# Altium schematic sheet Communications.SchDoc
size A4
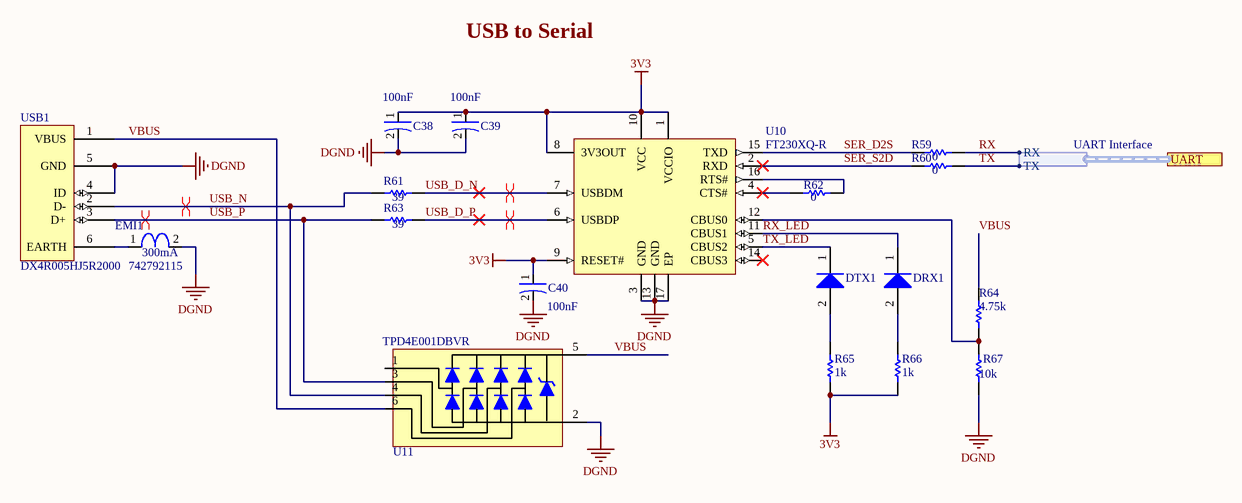
[diagram p0: Communications.SchDoc]

## Parts
C38  value 100nF  [0402-M]  (hidden comment: CAP 0.1uF CER 0402 16V X5R 10%)
C39  value 100nF  [0402-M]  (hidden comment: CAP 0.1uF CER 0402 16V X5R 10%)
C40  value 100nF  [0402-M]  (hidden comment: CAP 0.1uF CER 0402 16V X5R 10%)
DRX1  LED 0603 Green 20mA 1.8V  [0603 Generic]  (value not drawn)
DTX1  LED 0603 Red 20mA 1.7V  [0603 Generic]  (value not drawn)
EMI1  742792115  [1206-L]
R59  value 0  [0402-M]  (hidden comment: RES 0 0402 63mW)
R60  value 0  [0402-M]  (hidden comment: RES 0 0402 63mW)
R61  value 39  [0402-M]  (hidden comment: RES 39 0402 63mW 5%)
R62  value 0  [0402-M]  (hidden comment: RES 0 0402 63mW)
R63  value 39  [0402-M]  (hidden comment: RES 39 0402 63mW 5%)
R64  value 4.75k  [0402-M]  (hidden comment: RES 4.75k 0402 100mW 1%)
R65  value 1k  [0402-M]  (hidden comment: RES 1k 0402 63mW 1%)
R66  value 1k  [0402-M]  (hidden comment: RES 1k 0402 63mW 1%)
R67  value 10k  [0402-M]  (hidden comment: RES 10k 0402 63mW 5%)
U10  FT230XQ-R  [QFN-16_N - 0.3mm Vias]
U11  TPD4E001DBVR  [DBV6_N]
USB1  DX4R005HJ5R2000  [DX4R005HJ5R2000]

## Ports
UART (harness UART Interface)

## Harnesses
UART Interface: RX, TX

## Nets
3V3: C38.1(Anode) C39.1(Anode) C40.1(Anode) R65.1 R66.1 U10.1(VCCIO) U10.8(3V3OUT) U10.9(RESET#) U10.10(VCC)
DGND: C38.2(Cathode) C39.2(Cathode) C40.2(Cathode) EMI1.2 R67.1 U10.3(GND) U10.13(GND) U10.17(EP) U11.2(GND) USB1.4(ID) USB1.5(GND)
RX: R59.2 ; port UART.RX
RX_LED: DRX1.1 U10.11(CBUS1)
SER_D2S: R59.1 U10.15(TXD)
SER_S2D: R60.1 U10.2(RXD)
TX: R60.2 ; port UART.TX
TX_LED: DTX1.1 U10.5(CBUS2)
USB_D_N: R61.2 U10.7(USBDM)
USB_D_P: R63.2 U10.6(USBDP)
USB_N: R61.1 U11.4 USB1.2(D-)
USB_P: R63.1 U11.3 USB1.3(D+)
VBUS: R64.2 U11.5(GND) U11.6 USB1.1(VBUS)
NetDRX1_2: DRX1.2 R66.2
NetDTX1_2: DTX1.2 R65.2
NetEMI1_1: EMI1.1 USB1.6(EARTH)
NetR62_1: R62.1 U10.4(CTS#)
NetR62_2: R62.2 U10.16(RTS#)
NetR64_1: R64.1 R67.2 U10.12(CBUS0)

Not connected (* = marked no-connect by the designer): U10 14(CBUS3)*; U11 1

## Layout directives
differential pair: USB_D_N, USB_D_P, USB_N, USB_P

## Notes on the sheet
- USB to Serial

## Library data of the parts
C38-C40 = CAP 0.1uF CER 0402 16V X5R 10%-2: CAP-0.1uF-CER-0402-16V-X5R-10%; Manufacturer: Generic; Bin: CAP1-M1; Type: SMD; Supplier 1: Mouser; Supplier Part Number 1: 810-CGA2B2X5R1C104KA; Case/Package: 0402; Design Item ID: CAP 0.1uF CER 0402 16V X5R 10%; Source: Capacitor Library.SchLib; Status: Active
DRX1 = LED 0603 Green 20mA 1.8V-1: LED-0603-Green-20mA-1.8V-STOCK; Manufacturer: Generic; Bin: F2-DM1-1; Supplier 1: Mouser; Supplier Part Number 1: 645-598-8060-107F; Status: Active; Type: SMD; Case/Package: 0603; Design Item ID: LED 0603 Green 20mA 1.8V; Source: Diode Library.SchLib
DTX1 = LED 0603 Red 20mA 1.7V-1: LED-0603-Red-20mA-1.7V-STOCK; Manufacturer: Generic; Bin: F2-DM1-2; Supplier 1: Digi-Key; Supplier Part Number 1: 67-1551-6-ND; Status: Active; Type: SMD; Case/Package: 0603; Design Item ID: LED 0603 Red 20mA 1.7V; Source: Diode Library.SchLib
EMI1 = 74279211-2: FILTER-1206-CHIP-300mA-0.3Ohm-100MHz-25%; Manufacturer: Wurth; Value: 300mA; Bin: F2-L2-1; Supplier 1: Mouser; Supplier Part Number 1: 710-742792115; Status: Active; Type: SMD; Case/Package: 1206; ComponentLink1Description: Datasheet; ComponentLink1URL: https://eu.mouser.com/datasheet/2/445/742792115-1710682.pdf; Design Item ID: 74279211; Source: Inductor Library.SchLib
R59 R60 R62 = RES 0 0402 63mW-1: RES-0-0402-63mW-5%; Manufacturer: Generic; Bin: F1-RM1-5; MAPPING: 1(2,1,11.5k); Status: Active; Type: SMD; Case/Package: 0402; Design Item ID: RES 0 0402 63mW; Source: Resistor Library.SchLib
R61 R63 = RES 39 0402 63mW 5%-1: RES-39-0402-63mW-5%; Manufacturer: Generic; Bin: F1-R1-2; MAPPING: 1(2,1,11.5k); Status: Active; Type: SMD; Case/Package: 0402; Design Item ID: RES 39 0402 63mW 5%; Source: Resistor Library.SchLib
R64 = RES 4.75k 0402 100mW 1%-2: RES-4.75k-0402-100mW-1%; Manufacturer: Generic; Bin: F1-R7-7; Status: Active; Type: SMD; Case/Package: 0402; Design Item ID: RES 4.75k 0402 100mW 1%; Source: Resistor Library.SchLib
R65 R66 = RES 1k 0402 63mW 1%-1: RES-1k-0402-63mW-1%; Manufacturer: Generic; Bin: F1-R3-10; MAPPING: 1(2,1,11.5k); Status: Active; Type: SMD; Case/Package: 0402; Design Item ID: RES 1k 0402 63mW 1%; Source: Resistor Library.SchLib
R67 = RES 10k 0402 63mW 5%-1: RES-10k-0402-63mW-5%; Manufacturer: Generic; Bin: F1-R7-9; MAPPING: 1(2,1,11.5k); Status: Active; Type: SMD; Case/Package: 0402; Design Item ID: RES 10k 0402 63mW 5%; Source: Resistor Library.SchLib
U10 = FT230XQ-R-2: USB to Basic UART Interface Chip, UHCI/OHCI/EHCI Compatible, USB 2.0 Compatible, -40 to +85 degC, 16-Pin QFN, Pb-Free, Tape and Reel; Bin: B2-U4; Type: SMD; Datasheet: http://www.ftdichip.com/Support/Documents/DataSheets/ICs/DS_FT230X.pdf; Design Item ID: FT230XQ-R; Package: 16 QFN; Source: FTDI FT-X Series.SchLib; Status: Active; Supplier 1: Mouser; Supplier Part Number 1: 895-FT230XQ-R
U11 = CMP-00028-1: Low-Capacitance + / - 15-kV ESD Protection Array for High-Speed Data Interfaces, 4 Channels, -40 to +85 degC, 6-pin SOT-23 (DBV), Green (RoHS & no Sb/Br); Manufacturer: Texas Instruments; Serial ATA / eSATA: TRUE; Source: TI Interface ESD EMI Protection.SchLib; Datasheet: http://www.ti.com/general/docs/lit/getliterature.tsp?genericPartNumber=TPD4E001&fileType=pdf; Package: 6 SOT23; Design Item ID: TPD4E001DBVR; Status: Active; Type: SMD
USB1 = DX4R005HJ5R2000-1: CONN FEM SMD 5 90Deg Micro USB B; Manufacturer: JAE; Bin: B3-J3; Supplier 1: Digi-Key; Supplier Part Number 1: Digi-Key; Status: Active; Type: SMD; Case/Package: 24 PIN; Design Item ID: DX4R005HJ5R2000; Source: Connector Library.SchLib